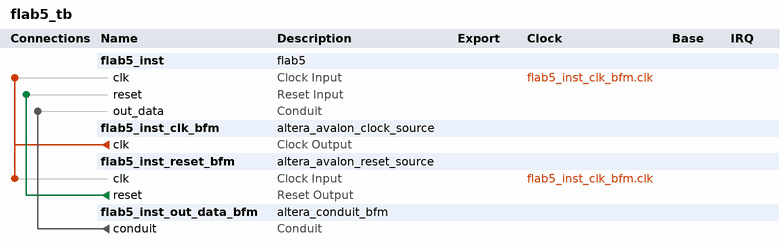
[diagram p0: system contents]
# Platform Designer (Qsys) system flab5_tb, Cyclone II EP2C5Q208C8
# Parameters at their usual value, and those the tool derives, are not listed.
package require -exact qsys 12.1
create_system flab5_tb
set_project_property DEVICE_FAMILY {Cyclone II}
set_project_property DEVICE EP2C5Q208C8

add_instance flab5_inst flab5 1.0

add_instance flab5_inst_clk_bfm altera_avalon_clock_source 12.1

add_instance flab5_inst_reset_bfm altera_avalon_reset_source 12.1
set_instance_parameter_value flab5_inst_reset_bfm ASSERT_HIGH_RESET 0
set_instance_parameter_value flab5_inst_reset_bfm INITIAL_RESET_CYCLES 50

add_instance flab5_inst_out_data_bfm altera_conduit_bfm 12.1
set_instance_parameter_value flab5_inst_out_data_bfm CLOCKED_SIGNAL false
set_instance_parameter_value flab5_inst_out_data_bfm ENABLE_RESET false
set_instance_parameter_value flab5_inst_out_data_bfm SIGNAL_WIDTHS 8
set_instance_parameter_value flab5_inst_out_data_bfm SIGNAL_DIRECTIONS input

# connections
add_connection flab5_inst_clk_bfm.clk flab5_inst.clk clock
add_connection flab5_inst_clk_bfm.clk flab5_inst_reset_bfm.clk clock
add_connection flab5_inst_reset_bfm.reset flab5_inst.reset reset
add_connection flab5_inst_out_data_bfm.conduit flab5_inst.out_data conduit

save_system flab5_tb.qsys
